# EAGLE schematic LoraTester1 Mk1 Schematic v36 (EAGLE 9.7.0)
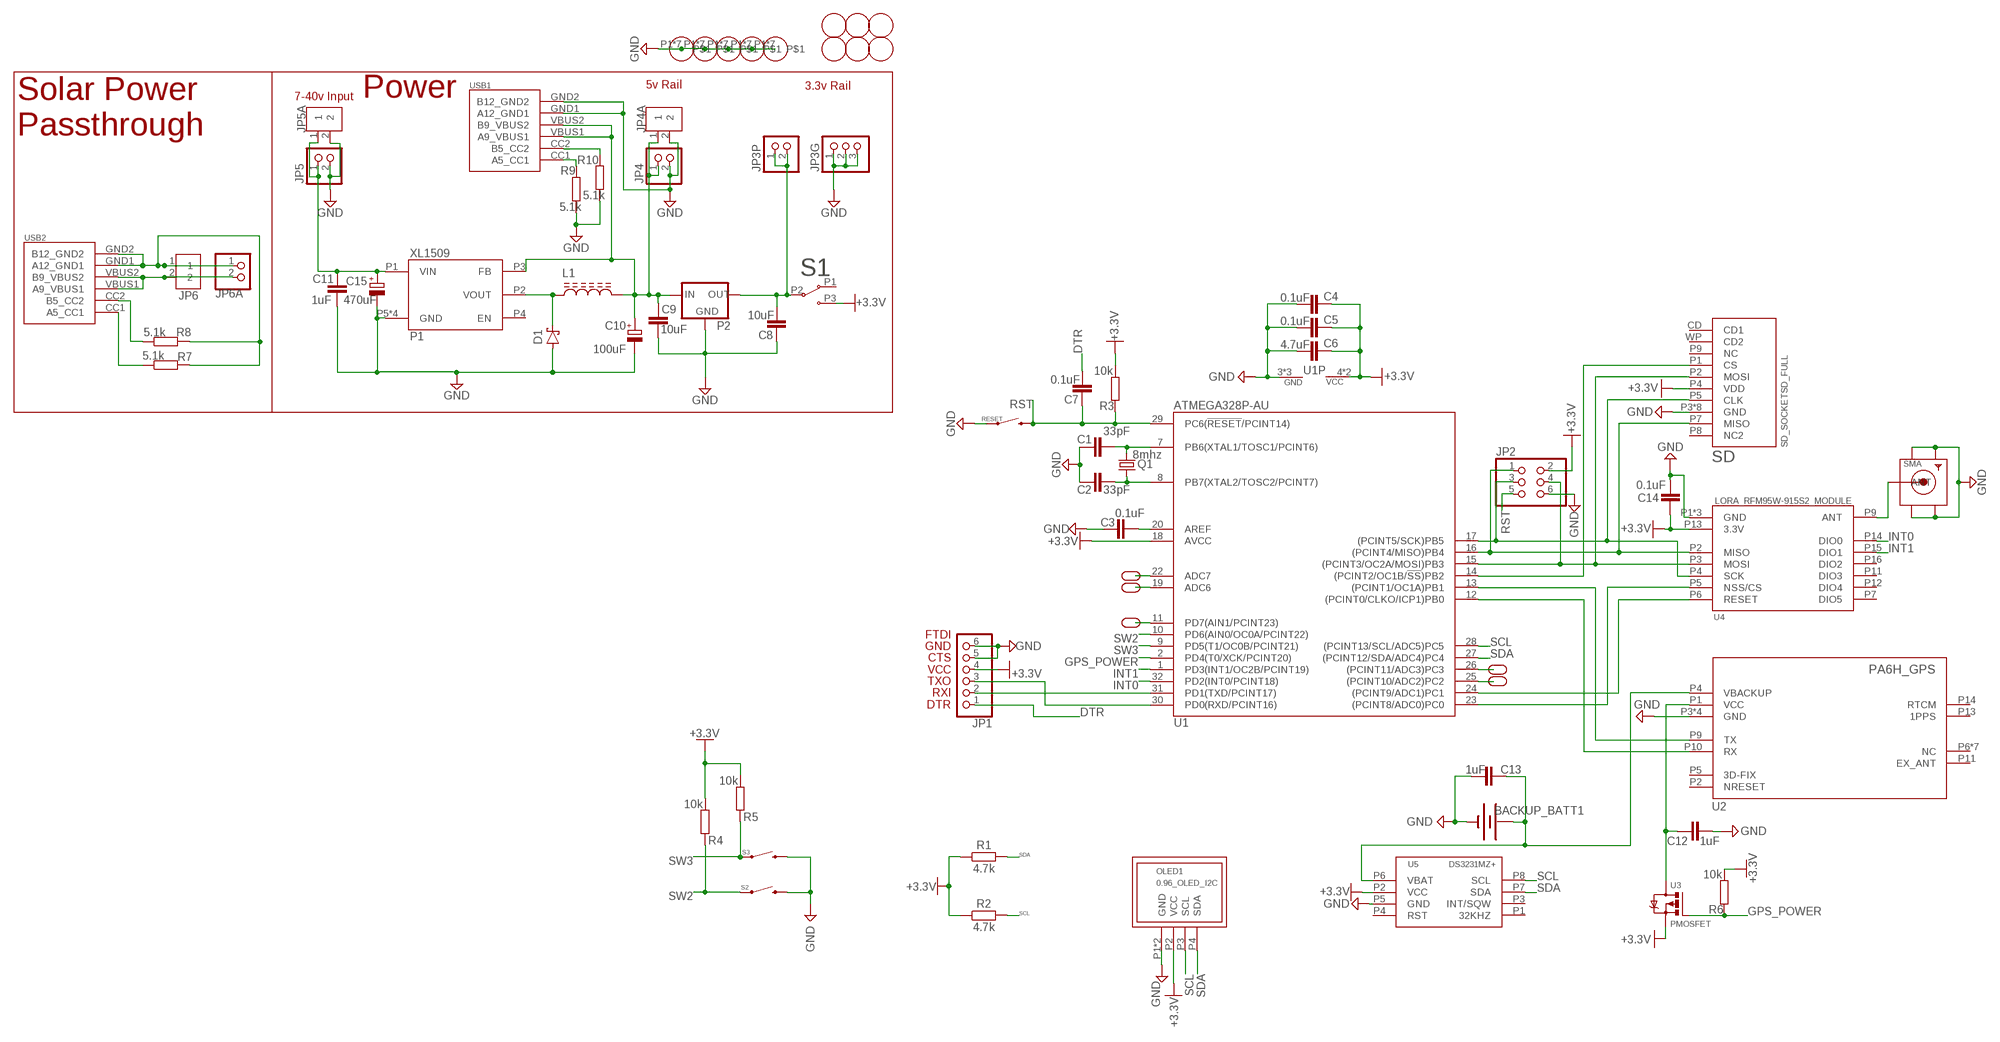
[diagram p0: schematic, sheet 1]

## Parts
ADC6  BREAKOUT_PADBREAKOUT_THT  [BREAKOUT_THT*1*1MM]
ADC7  BREAKOUT_PADBREAKOUT_THT  [BREAKOUT_THT*1*1MM]
BACKUP_BATT1  BATTERY-20MM_PTH  [BATTCOM_20MM_PTH]
C1  33pF  C_CHIP-0805(2012-METRIC)  [CAPC2012X110]
C2  33pF  C_CHIP-0805(2012-METRIC)  [CAPC2012X110]
C3  0.1uF  C_CHIP-0805(2012-METRIC)  [CAPC2012X110]
C4  0.1uF  C_CHIP-0805(2012-METRIC)  [CAPC2012X110]
C5  0.1uF  C_CHIP-0805(2012-METRIC)  [CAPC2012X110]
C6  4.7uF  C_CHIP-0805(2012-METRIC)  [CAPC2012X110]
C7  0.1uF  C_CHIP-0805(2012-METRIC)  [CAPC2012X110]
C8  10uF  C_CHIP-0805(2012-METRIC)  [CAPC2012X110]
C9  10uF  C_CHIP-0805(2012-METRIC)  [CAPC2012X110]
C10  100uF  C-POL  [CAP_2P_5X11]
C11  1uF  C_CHIP-0805(2012-METRIC)  [CAPC2012X110]
C12  1uF  C_CHIP-0805(2012-METRIC)  [CAPC2012X110]
C13  1uF  C_CHIP-0805(2012-METRIC)  [CAPC2012X110]
C14  0.1uF  C_CHIP-0805(2012-METRIC)  [CAPC2012X110]
C15  470uF  C-POLCAP_5P_5X11  [CAP_5P_10X12.5]
D1  SCHOTTKY_DO-219  [SODFL3718X115]
F1  FIDUCIAL  [FIDUCIAL_1MM]
F2  FIDUCIAL  [FIDUCIAL_1MM]
F3  FIDUCIAL  [FIDUCIAL_1MM]
F4  FIDUCIAL  [FIDUCIAL_1MM]
F5  FIDUCIAL  [FIDUCIAL_1MM]
F6  FIDUCIAL  [FIDUCIAL_1MM]
JP1  PINHD-1X6  [1X06]
JP2  PINHD-2X3  [2X03]
JP3G  PINHD-1X3  [1X03]
JP3P  PINHD-1X2  [1X02]
JP4  PINHD-1X2  [1X02]
JP4A  2828XX-2282837-2  [TERMBLK_508-2N]
JP5  PINHD-1X2  [1X02]
JP5A  2828XX-2282837-2  [TERMBLK_508-2N]
JP6  2828XX-2282837-2  [TERMBLK_508-2N]
JP6A  PINHD-1X2  [1X02]
L1  68uh  INDUCTOR_12MM_SHIELDED  [INDUCTOR_12X12MM]
M1  MOUNTING_HOLES  [MOUNTING_HOLE_3MM]
M2  MOUNTING_HOLES  [MOUNTING_HOLE_3MM]
M3  MOUNTING_HOLES  [MOUNTING_HOLE_3MM]
M4  MOUNTING_HOLES  [MOUNTING_HOLE_3MM]
M5  MOUNTING_HOLES  [MOUNTING_HOLE_3MM]
OLED1  0.96_OLED_I2C  [OLED_0.96_I2C]
P1  XL1509  [XL1509_SOIC8]
P2  LDO-LM11173.3MP  [SOT223]
PC2  BREAKOUT_PADBREAKOUT_THT  [BREAKOUT_THT*1*1MM]
PC3  BREAKOUT_PADBREAKOUT_THT  [BREAKOUT_THT*1*1MM]
PD7  BREAKOUT_PADBREAKOUT_THT  [BREAKOUT_THT*1*1MM]
Q1  8mhz  CRYSTALHC49UP  [HC49UP]
R1  4.7k  R_CHIP-0805(2012-METRIC)  [RESC2012X65]
R2  4.7k  R_CHIP-0805(2012-METRIC)  [RESC2012X65]
R3  10k  R_CHIP-0805(2012-METRIC)  [RESC2012X65]
R4  10k  R_CHIP-0805(2012-METRIC)  [RESC2012X65]
R5  10k  R_CHIP-0805(2012-METRIC)  [RESC2012X65]
R6  10k  R_CHIP-0805(2012-METRIC)  [RESC2012X65]
R7  5.1k  R_CHIP-0805(2012-METRIC)  [RESC2012X65]
R8  5.1k  R_CHIP-0805(2012-METRIC)  [RESC2012X65]
R9  5.1k  R_CHIP-0805(2012-METRIC)  [RESC2012X65]
R10  5.1k  R_CHIP-0805(2012-METRIC)  [RESC2012X65]
RESET  MOMENTARY-SWITCH-SPST-PTH-6.0MM  [TACTILE_SWITCH_PTH_6.0MM]
S1  1P2T_SLIDE_SWITCH  [1P2T_SLIDE_SWITCH]
S2  MOMENTARY-SWITCH-SPST-PTH-12MM  [TACTILE_SWITCH_PTH_12MM]
S3  MOMENTARY-SWITCH-SPST-PTH-12MM  [TACTILE_SWITCH_PTH_12MM]
SD  SD_SOCKETSD_FULL  [SD_CARD_SOCKET-794212]
SMA  SMACONNECTOR_EDGE  [SMA_EDGELAUNCH]
U1  ATMEGA328P-AU  [QFP32_7X7_0.80]
U2  PA6H_GPS  [PA6H_GPS-MODULE_20PIN]
U3  PMOSFET  PMOSFET_SOT23  [SOT23]
U4  LORA_RFM95W-915S2_MODULE  [LORA_RFM95W-915S2_16MODULE]
U5  DS3231MZ+  [DS3231MZ+_SOIC8]
USB1  USB-C_POWER_SUN5463  [USB-C_POWER_SUN5463]
USB2  USB-C_POWER_SUN5463  [USB-C_POWER_SUN5463]

## Nets
3.3V_GPS [Power]: C12.1 U2.P1(VCC) U3.3(D)
5V [Power]: C9.1 C10.1(+) JP4.1 JP4A.1 L1.P$2(A2) P1.P3(FB) P2.3(IN) USB1.VBUS1(A9_VBUS1) USB1.VBUS2(B9_VBUS2)
+3.3V [Power]: C4.1 C5.1 C6.1 C14.1 JP1.4 JP2.2 OLED1.P2(VCC) R1.1 R2.1 R3.1 R4.1 R5.1 R6.1 S1.P3 SD.P4(VDD) U1.4(VCC) U1.6(VCC) U1.18(AVCC) U3.2(S) U4.P13(3.3V) U5.P2(VCC)
ADC6: ADC6.P$1 U1.19(ADC6)
ADC7: ADC7.P$1 U1.22(ADC7)
AMSVO [Power]: C8.2 JP3P.1 JP3P.2 P2.2(OUT) P2.4(OUT) S1.P2
AREF: C3.2 U1.20(AREF)
CC1: R9.2 USB1.CC1(A5_CC1)
CC2: R10.2 USB1.CC2(B5_CC2)
CS_LR: U1.23((PCINT8/ADC0)PC0) U4.P5(NSS/CS)
CS_SD: SD.P1(CS) U1.14((PCINT2/OC1B/!SS!)PB2)
DTR: C7.2 JP1.1
GND [Power]: BACKUP_BATT1.2(-) C1.1 C2.1 C3.1 C4.2 C5.2 C6.2 C8.1 C9.2 C10.2(-) C11.2 C12.2 C13.2 C14.2 C15.2(-) D1.2(A) JP1.5 JP1.6 JP2.6 JP3G.1 JP3G.2 JP3G.3 JP4.2 JP4A.2 JP5.2 JP5A.2 M1.P1 M1.P2 M1.P3 M1.P4 M1.P5 M1.P6 M1.P7 M2.P1 M2.P2 M2.P3 M2.P4 M2.P5 M2.P6 M2.P7 M3.P1 M3.P2 M3.P3 M3.P4 M3.P5 M3.P6 M3.P7 M4.P1 M4.P2 M4.P3 M4.P4 M4.P5 M4.P6 M4.P7 M5.P1 M5.P2 M5.P3 M5.P4 M5.P5 M5.P6 M5.P7 OLED1.P1(GND) OLED1.P9(GND) P1.P5(GND) P1.P6(GND) P1.P7(GND) P1.P8(GND) P2.1(GND) R9.1 R10.1 RESET.1 RESET.2 S2.3 S2.4 S3.3 S3.4 SD.P3(GND) SD.P6(GND) SD.P12(GND) SD.P13(GND) SD.P14(GND) SD.P15(GND) SD.P16(GND) SD.P17(GND) SMA.GND@1(GND4) SMA.GND@2(GND3) SMA.GND@3(GND2) SMA.GND@4(GND1) U1.3(GND) U1.5(GND) U1.21(GND) U2.P3(GND) U2.P8(GND) U2.P12(GND) U2.P19(GND) U4.P1(GND) U4.P8(GND) U4.P10(GND) U5.P5(GND) USB1.GND1(A12_GND1) USB1.GND2(B12_GND2)
GPS_POWER: R6.2 U1.2(PD4(T0/XCK/PCINT20)) U3.1(G)
INT0: U1.32(PD2(INT0/PCINT18)) U4.P14(DIO0)
INT1: U1.1(PD3(INT1/OC2B/PCINT19)) U4.P15(DIO1)
MISO: JP2.1 SD.P7(MISO) U1.16((PCINT4/MISO)PB4) U4.P2(MISO)
MOSI: JP2.4 SD.P2(MOSI) U1.15((PCINT3/OC2A/MOSI)PB3) U4.P3(MOSI)
PC2: PC2.P$1 U1.25((PCINT10/ADC2)PC2)
PC3: PC3.P$1 U1.26((PCINT11/ADC3)PC3)
PD7: PD7.P$1 U1.11(PD7(AIN1/PCINT23))
Q1: C1.2 Q1.2 U1.7(PB6(XTAL1/TOSC1/PCINT6))
Q2: C2.2 Q1.1 U1.8(PB7(XTAL2/TOSC2/PCINT7))
RDX: JP1.3 U1.30(PD0(RXD/PCINT16))
RESET_LR: U1.24((PCINT9/ADC1)PC1) U4.P6(RESET)
RST: C7.1 JP2.5 R3.2 RESET.3 RESET.4 U1.29(PC6(!RESET!/PCINT14))
RTC_BATT [Power]: BACKUP_BATT1.1(+) C13.1 U2.P4(VBACKUP) U5.P6(VBAT)
RX_GPS: U1.12((PCINT0/CLKO/ICP1)PB0) U2.P10(RX)
S_CC1: R7.1 USB2.CC1(A5_CC1)
S_CC2: R8.1 USB2.CC2(B5_CC2)
S_GND [Power]: JP6.1 JP6A.1 R7.2 R8.2 USB2.GND1(A12_GND1) USB2.GND2(B12_GND2)
S_VCC [Power]: JP6.2 JP6A.2 USB2.VBUS1(A9_VBUS1) USB2.VBUS2(B9_VBUS2)
SCK: JP2.3 SD.P5(CLK) U1.17((PCINT5/SCK)PB5) U4.P4(SCK)
SCL: OLED1.P3(SCL) R2.2 U1.28((PCINT13/SCL/ADC5)PC5) U5.P8(SCL)
SDA: OLED1.P4(SDA) R1.2 U1.27((PCINT12/SDA/ADC4)PC4) U5.P7(SDA)
SMA-ANT [RF]: SMA.P(ANT) U4.P9(ANT)
SW2: R4.2 S2.1 S2.2 U1.10(PD6(AIN0/OC0A/PCINT22))
SW3: R5.2 S3.1 S3.2 U1.9(PD5(T1/OC0B/PCINT21))
TX_GPS: U1.13((PCINT1/OC1A)PB1) U2.P9(TX)
TXD: JP1.2 U1.31(PD1(TXD/PCINT17))
VIN [Power]: C11.1 C15.1(+) JP5.1 JP5A.1 P1.P1(VIN)
XLVO [Power]: D1.1(C) L1.P$1(A1) P1.P2(VOUT)
Unconnected: P1.P4(EN) S1.P1 SD.CD(CD1) SD.P8(NC2) SD.P9(NC) SD.WP(CD2) U2.P2(NRESET) U2.P5(3D-FIX) U2.P6(NC) U2.P7(NC) U2.P11(EX_ANT) U2.P13(1PPS) U2.P14(RTCM) U2.P15(NC) U2.P16(NC) U2.P17(NC) U2.P18(NC) U2.P20(NC) U4.P7(DIO5) U4.P11(DIO3) U4.P12(DIO4) U4.P16(DIO2) U5.P1(32KHZ) U5.P3(INT/SQW) U5.P4(RST)

## Notes on the sheet
- Solar Power
  Passthrough
- 5v Rail | 3.3v Rail
- 7-40v Input | Power
- FTDI
  GND
  CTS
  VCC
  TXO
  RXI
  DTR

## Library data of the parts
ADC6 ADC7 PC2 PC3 PD7 = CDC Library:BREAKOUT_PAD
BACKUP_BATT1 = CDC Library:BATTERY: Battery - Single Cell A variety of battery chemistries, sizes, and footprints. Device List: 20MM_PTH - Coin Cell Battery Holder - 20mm (PTH) <https://www.sparkfun.com/products/783> 6.8MM_PTH - Coin Cell Battery Holder - 6.8MM(SMD) <https://www.digikey.com/product-detail/en/seiko-instruments/MS621FE-FL11E/728-1057-ND/1889208?WT.srch=1&gclid=CNOQ5a6LzdQCFZS2wAodXCkE0g> 12MM_SMD - Coin Cell Battery Holder - 12mm (SMD) <https://www.sparkfun.com/products/10592> 12MM_PTH - Coin Cell Battery Holder - 12mm (PTH) <https://www.sparkfun.com/products/7948> 20MM_SMD - 20mm Coin Cell Battery Holder (SMD) (2 legs) Used on the Big Time Watch Kit <https://www.sparkfun.com/products/11734> 20MM_SMD_4LEGS - Coin Cell Battery Holder - 20mm (SMD) <https://www.sparkfun.com/products/11892> 20MM_SMD_4LEGS_OVERPASTE - Coin Cell Battery Holder - 20mm (SMD) <https://www.sparkfun.com/products/11892> (Over-paste on the legs) 24.5MM_PTH - Coin Cell Battery Holder - 24.5mm (PTH) <https://www.sparkfun.com/products/8863> 9V - 9V Battery Holder - PC Mount Used on the SparkFun SparkPunk Sound Kit <https://www.sparkfun.com/products/11177> and SparkFun SparkPunk Sequencer Kit <https://www.sparkfun.com/products/12707> 18650 - Battery Holder - 18650 (PTH) <https://www.sparkfun.com/products/13113> AA - Battery Holder - 1xAA (PTH) <https://www.sparkfun.com/products/7949> AAA - Battery Holder - 1xAAA (PTH) <https://www.sparkfun.com/products/12718> AA_KIT - Battery Holder - 1xAA (PTH) <https://www.sparkfun.com/products/7949> Special kit package - pads only have exposed copper on one side of the board. AAA_KIT - Battery Holder - 1xAAA (PTH) <https://www.sparkfun.com/products/12718> Special kit package - pads only have exposed copper on one side of the board.; LINK: https://www.evelta.com/3v-litium-battery-holder/; PROD_ID: BATT-09031; SF_SKU: PRT-00783
C1 C2 = Capacitor:C: Capacitor - Generic; CATEGORY: Capacitor; LINK: https://www.evelta.com/33-pf-50v-0805-smd-multilayer-ceramic-capacitors-0805cg330j500nt-fenghua/
C3-C5 C7 C14 = Capacitor:C: Capacitor - Generic; CATEGORY: Capacitor; LINK: https://www.sunrom.com/p/100nf-104-smd-0805-pack-of-20
C6 = Capacitor:C: Capacitor - Generic; CATEGORY: Capacitor; LINK: https://www.evelta.com/4-7-uf-16v-0805-smd-multi-layer-ceramic-capacitor-0805x475k160ct-walsin/
C8 C9 = Capacitor:C: Capacitor - Generic; CATEGORY: Capacitor; LINK: https://www.sunrom.com/p/10uf-106-smd-0805-pack-of-10
C10 = CDC Library:C-POL: Capacitor Polarised - Generic; LINK: https://www.evelta.com/100uf-25v-electrolytic-capacitor/
C11-C13 = Capacitor:C: Capacitor - Generic; CATEGORY: Capacitor; LINK: https://www.sunrom.com/p/1uf-105-smd-0805-pack-of-10
C15 = CDC Library:C-POL: Capacitor Polarised - Generic; LINK: https://www.evelta.com/470uf-25v-electrolytic-capacitor/
D1 = CDC Library:SCHOTTKY_: Schottky Diode - Popular parts; LINK: https://www.sunrom.com/p/1n5819-b5819w-1n5819w-s4-sod123-1206-1a-40v-schottky-diode
F1-F6 = CDC Library:FIDUCIAL: For use by pick and place machines to calibrate the vision/machine, 1mm By microbuilder.eu
JP1 = Connector:PINHD-1X6: PIN HEADER; CATEGORY: CONNECTOR; SUB-CATEGORY: PIN-HEADER
JP2 = Connector:PINHD-2X3: PIN HEADER; CATEGORY: CONNECTOR; SUB-CATEGORY: PIN-HEADER
JP3G = Connector:PINHD-1X3: PIN HEADER; CATEGORY: CONNECTOR; SUB-CATEGORY: PIN-HEADER
JP3P JP4 JP5 JP6A = Connector:PINHD-1X2: PIN HEADER; CATEGORY: CONNECTOR; SUB-CATEGORY: PIN-HEADER
JP4A JP5A JP6 = Connector:2828XX-2: 2 Position Wire to Board Terminal Block Horizontal with Board Datasheet <https://www.te.com.cn/commerce/DocumentDelivery/DDEController?Action=showdoc&DocId=Catalog+Section%7F1308389_EUROSTYLE_TERMINAL_BLOCKS%7F0607%7Fpdf%7FEnglish%7FENG_CS_1308389_EUROSTYLE_TERMINAL_BLOCKS_0607.pdf%7F2-282837-5>; CATEGORY: Connector; DESCRIPTION: 2 Position Wire to Board Terminal Block Horizontal with Board 5.08 mm Through Hole; MANUFACTURER: TE Connectivity; MPN: 282837-2; OPERATING_TEMPERATURE: -40°C to +105°C; PART_STATUS: ACTIVE; ROHS_COMPLIANCE: RoHS Compliant; SERIES: 282837; SUBCATEGORY: Terminal Block; TYPE: Side Wire Entry
L1 = CDC Library:INDUCTOR_12MM_SHIELDED; LINK: https://www.sunrom.com/p/68uh-680-12mm-inductor
M1-M5 = CDC Library:MOUNTING_HOLES
OLED1 = CDC Library:0.96_OLED_I2C
P1 = CDC Library:XL1509; LINK: https://www.sunrom.com/m/6161
P2 = CDC Library:LDO-LM1117: 800mA Low-Dropout Linear Regulator Source: http://ww1.microchip.com/downloads/en/DeviceDoc/39760d.pdf; LINK: https://www.sunrom.com/m/4004; MF: Texas Instruments; MPN: LM1117MP-3.3; OC_FARNELL: 9778195; OC_NEWARK: 28X3416
Q1 = CDC Library:CRYSTAL: CRYSTAL; LINK: https://www.evelta.com/hc-49smd-8mhz-20pf-20ppm-2pad-smd-smt-quartz-crystal/; OC_FARNELL: unknown; OC_NEWARK: unknown
R1 R2 = Resistor:R: Resistor Fixed - Generic; CATEGORY: Resistor; LINK: https://www.sunrom.com/p/4k7-1-0805-pack-of-100; SUB-CATEGORY: Fixed
R3-R6 = Resistor:R: Resistor Fixed - Generic; CATEGORY: Resistor; LINK: https://www.sunrom.com/p/10k-1-0805-pack-of-100; SUB-CATEGORY: Fixed
R7-R10 = Resistor:R: Resistor Fixed - Generic; CATEGORY: Resistor; LINK: https://www.evelta.com/5k1-5-0805-smd-resistor-royal-ohm-0805W8J0512T5E/; SUB-CATEGORY: Fixed
RESET = CDC Library:MOMENTARY-SWITCH-SPST: Momentary Switch (Pushbutton) - SPST Normally-open (NO) SPST momentary switches (buttons, pushbuttons). Variants PTH-12MM - 12mm square, through-hole Momentary Pushbutton Switch - 12mm Square <https://www.sparkfun.com/products/9190> (COM-09190) PTH-6.0MM, PTH-6.0MM-KIT - 6.0mm square, through-hole Mini Pushbutton Switch <https://www.sparkfun.com/products/97> (COM-00097) KIT package intended for soldering kit's - only one side of pads' copper is exposed. PTH-RIGHT-ANGLE-KIT - Right-angle, through-hole Right Angle Tactile Button <https://www.sparkfun.com/products/10791> - Used on SparkFun BigTime Watch Kit <https://www.sparkfun.com/products/11734> SMD-12MM - 12mm square, surface-mount Tactile Button - SMD (12mm) <https://www.sparkfun.com/products/12993> (COM-12993) Used on SparkFun PicoBoard <https://www.sparkfun.com/products/11888> SMD-4.5MM - 4.5mm Square Trackball Switch Used on SparkFun Blackberry Trackballer Breakout <https://www.sparkfun.com/products/13169> SMD-4.6MMX2.8MM - 4.60mm x 2.80mm, surface mount Used on SparkFun SAMD21 Mini Breakout <https://www.sparkfun.com/products/13664> SMD-5.2MM, SMD-5.2-REDUNDANT - 5.2mm square, surface-mount Mini Pushbutton Switch - SMD <https://www.sparkfun.com/products/8720> (COM-08720) Used on Arduino Pro Mini <https://www.sparkfun.com/products/11114> REDUNDANT package connects both switch circuits together SMD-6.0X3.5MM - 6.0 x 3.5mm, surface mount Momentary Reset Switch SMD <https://www.sparkfun.com/products/8229> (COM-08229) SMD-6.2MM-TALL - 6.2mm square, surface mount Tactile Button - SMD (6mm) <https://www.sparkfun.com/products/12992> Used on SparkFun Digital Sandbox <https://www.sparkfun.com/products/12651> SMD-RIGHT-ANGLE - Right-angle, surface mount Used on SparkFun Block for Intel® Edison - Arduino <https://www.sparkfun.com/products/13036>; LINK: https://www.sunrom.com/p/tactile-switch-6x6x43mm; PROD_ID: SWCH-08441; SF_SKU: COM-00097
S1 = CDC Library:1P2T_SLIDE_SWITCH; LINK: https://www.sunrom.com/p/slide-switch-1p2t-high-current-straight
S2 S3 = CDC Library:MOMENTARY-SWITCH-SPST: Momentary Switch (Pushbutton) - SPST Normally-open (NO) SPST momentary switches (buttons, pushbuttons). Variants PTH-12MM - 12mm square, through-hole Momentary Pushbutton Switch - 12mm Square <https://www.sparkfun.com/products/9190> (COM-09190) PTH-6.0MM, PTH-6.0MM-KIT - 6.0mm square, through-hole Mini Pushbutton Switch <https://www.sparkfun.com/products/97> (COM-00097) KIT package intended for soldering kit's - only one side of pads' copper is exposed. PTH-RIGHT-ANGLE-KIT - Right-angle, through-hole Right Angle Tactile Button <https://www.sparkfun.com/products/10791> - Used on SparkFun BigTime Watch Kit <https://www.sparkfun.com/products/11734> SMD-12MM - 12mm square, surface-mount Tactile Button - SMD (12mm) <https://www.sparkfun.com/products/12993> (COM-12993) Used on SparkFun PicoBoard <https://www.sparkfun.com/products/11888> SMD-4.5MM - 4.5mm Square Trackball Switch Used on SparkFun Blackberry Trackballer Breakout <https://www.sparkfun.com/products/13169> SMD-4.6MMX2.8MM - 4.60mm x 2.80mm, surface mount Used on SparkFun SAMD21 Mini Breakout <https://www.sparkfun.com/products/13664> SMD-5.2MM, SMD-5.2-REDUNDANT - 5.2mm square, surface-mount Mini Pushbutton Switch - SMD <https://www.sparkfun.com/products/8720> (COM-08720) Used on Arduino Pro Mini <https://www.sparkfun.com/products/11114> REDUNDANT package connects both switch circuits together SMD-6.0X3.5MM - 6.0 x 3.5mm, surface mount Momentary Reset Switch SMD <https://www.sparkfun.com/products/8229> (COM-08229) SMD-6.2MM-TALL - 6.2mm square, surface mount Tactile Button - SMD (6mm) <https://www.sparkfun.com/products/12992> Used on SparkFun Digital Sandbox <https://www.sparkfun.com/products/12651> SMD-RIGHT-ANGLE - Right-angle, surface mount Used on SparkFun Block for Intel® Edison - Arduino <https://www.sparkfun.com/products/13036>; LINK: https://www.sunrom.com/p/tactile-switch-square-head-omron-b3f-4055-12x12x73mm; PROD_ID: SWCH-09185; SF_SKU: COM-09190
SD = CDC Library:SD_SOCKET; LINK: https://www.sunrom.com/p/full-sd-card-socket
SMA = CDC Library:SMACONNECTOR: SMA Connector 90° DIP SMA Connector, 50 Ohm (4UConnector: 07259)
U1 = CDC Library:ATMEGA*8: 8-bit AVR Microcontroller 4/8/16/32 kbytes flash 512/1k/1k/2k bytes SRAM 256/512/512/1k bytes EEPROM USART, 6/8-channel 10 bit ADC Pin compatible with Atmega8(L,A) Note: ADC6 and ADC7 are not available in 28-lead packages; LINK: https://www.evelta.com/atmega328p-au-ic-mcu-8bit-32kb-flash-32tqfp/
U2 = CDC Library:PA6H_GPS; LINK: https://www.rhydolabz.com/wireless-gps-c-130_186/gps-smd-module-with-antennapa6h-p-1911.html
U3 = Transistor:PMOSFET: P-Channel MOSFET - Generic; CATEGORY: Transistor; LINK1: https://www.sunrom.com/p/ao3401-a19t-sot-23-p-ch-mosfet; SUB-CATEGORY: MOSFET; TYPE: P-Channel
U4 = CDC Library:LORA_RFM95W-915S2_MODULE; LINK: https://www.digikey.in/product-detail/en/rf-solutions/RFM95W-915S2/RFM95W-915S2-ND/6564923
U5 = CDC Library:DS3231MZ+; LINK: https://www.evelta.com/ds3231mz-maxim-integrated-alarm-rtc-i2c-2-3-v-to-5-5-v/
USB1 USB2 = CDC Library:USB-C_POWER_SUN5463

## Net classes
1 Power: width 0.4 mm